# Altium schematic sheet 7_power_prot_mon.SchDoc
size A4; OrganizationName: Pluton UPV; Address1: Universitat Politècnica; Address2: de València (UPV); Address3: Camí de Vera, València; Address4: Spain; SheetNumber: 7; SheetTotal: 8
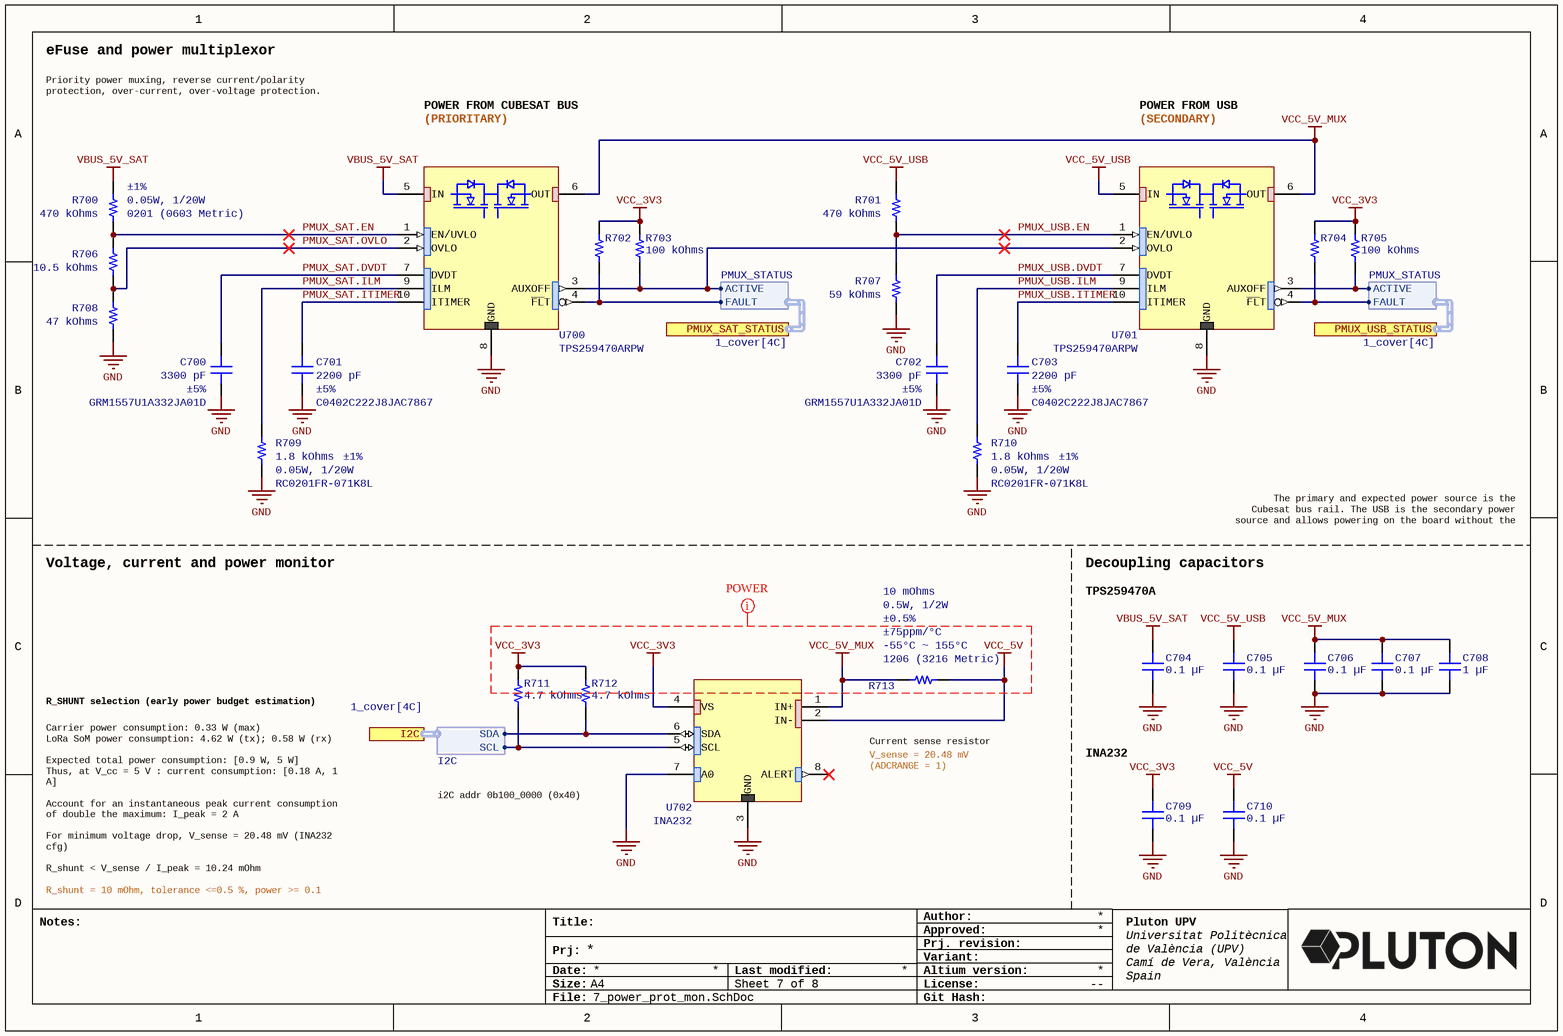
[diagram p0: 7_power_prot_mon.SchDoc]

## Parts
C700  Part Number: GRM1557U1A332JA01D  Tolerance: ±5%  [CAP 0402_1005]  (hidden comment: 3300 pF)
C701  Part Number: C0402C222J8JAC7867  Tolerance: ±5%  [CAP 0402_1005]  (hidden comment: 2200 pF)
C702  Part Number: GRM1557U1A332JA01D  Tolerance: ±5%  [CAP 0402_1005]  (hidden comment: 3300 pF)
C703  Part Number: C0402C222J8JAC7867  Tolerance: ±5%  [CAP 0402_1005]  (hidden comment: 2200 pF)
C704  0.1 µF  [CAP 0402_1005]
C705  0.1 µF  [CAP 0402_1005]
C706  0.1 µF  [CAP 0402_1005]
C707  0.1 µF  [CAP 0402_1005]
C708  1 µF  [CAP 0402_1005]
C709  0.1 µF  [CAP 0402_1005]
C710  0.1 µF  [CAP 0402_1005]
R700  470 kOhms  [RES 0201_0603]
R701  470 kOhms  [RES 0201_0603]
R702  100 kOhms  [RES 0201_0603]  (value not drawn)
R703  100 kOhms  [RES 0201_0603]
R704  100 kOhms  [RES 0201_0603]  (value not drawn)
R705  100 kOhms  [RES 0201_0603]
R706  10.5 kOhms  [RES 0201_0603]
R707  59 kOhms  [RES 0201_0603]
R708  Package / Case: 0201 (0603 Metric)  Power (Watts): 0.05W, 1/20W  Tolerance: ±1%  [RES 0201_0603]  (hidden comment: 47 kOhms)
R709  Part Number: RC0201FR-071K8L  Power (Watts): 0.05W, 1/20W  Tolerance: ±1%  [RES 0201_0603]  (hidden comment: 1.8 kOhms)
R710  Part Number: RC0201FR-071K8L  Power (Watts): 0.05W, 1/20W  Tolerance: ±1%  [RES 0201_0603]  (hidden comment: 1.8 kOhms)
R711  4.7 kOhms  [RES 0201_0603]
R712  4.7 kOhms  [RES 0201_0603]
R713  Package / Case: 1206 (3216 Metric)  Operating Temperature: -55°C ~ 155°C  Power (Watts): 0.5W, 1/2W  Temperature Coefficient: ±75ppm/°C  Tolerance: ±0.5%  [STACKPOLE CSR1206]  (hidden comment: 10 mOhms)
U700  TPS259470ARPW  [VQFN-HR-TPS25947X]
U701  TPS259470ARPW  [VQFN-HR-TPS25947X]
U702  INA232  [SOp-23-8]

## Ports
I2C (harness I2C, see 1_cover[4C]), PMUX_SAT_STATUS (harness PMUX_STATUS, see 1_cover[4C]), PMUX_USB_STATUS (harness PMUX_STATUS, see 1_cover[4C])

## Harnesses
I2C: SCL, SDA
PMUX_STATUS: ACTIVE, FAULT

## Nets
GND: C700.1 C701.1 C702.1 C703.1 C704.1 C705.1 C706.1 C707.1 C708.1 C709.1 C710.1 R707.1 R708.1 R709.1 R710.1 U700.8(GND) U701.8(GND) U702.3(GND) U702.7(A0)
VBUS_5V_SAT: C704.2 R700.2 U700.5(IN)
VCC_3V3: C709.2 R702.1 R703.1 R704.1 R705.1 R711.2 R712.2 U702.4(VS)
VCC_5V: C710.2 R713.1 U702.2(IN-)
VCC_5V_MUX: C706.2 C707.2 C708.2 R713.2 U700.6(OUT) U701.6(OUT) U702.1(IN+)
VCC_5V_USB: C705.2 R701.2 U701.5(IN)
PMUX_SAT.DVDT: C700.2 U700.7(DVDT)
PMUX_SAT.EN: R700.1 R706.2 U700.1(EN/UVLO)
PMUX_SAT.ILM: R709.2 U700.9(ILM)
PMUX_SAT.ITIMER: C701.2 U700.10(ITIMER)
PMUX_SAT.OVLO: R706.1 R708.2 U700.2(OVLO)
PMUX_USB.DVDT: C702.2 U701.7(DVDT)
PMUX_USB.EN: R701.1 R707.2 U701.1(EN/UVLO)
PMUX_USB.ILM: R710.2 U701.9(ILM)
PMUX_USB.ITIMER: C703.2 U701.10(ITIMER)
NetR702_2: R702.2 U700.4(~{FL}T) ; port PMUX_SAT_STATUS.FAULT
NetR703_2: R703.2 U700.3(AUXOFF) U701.2(OVLO) ; port PMUX_SAT_STATUS.ACTIVE
NetR704_2: R704.2 U701.4(~{FL}T) ; port PMUX_USB_STATUS.FAULT
NetR705_2: R705.2 U701.3(AUXOFF) ; port PMUX_USB_STATUS.ACTIVE
NetR711_1: R711.1 U702.5(SCL) ; port I2C.SCL
NetR712_1: R712.1 U702.6(SDA) ; port I2C.SDA

Not connected (* = marked no-connect by the designer): U702 8(ALERT)*

## Layout directives
rule Width Constraint [Pref Width = 0.4mm    Min Width = 0.2mm    Max Width = 2mm]; net class POWER: VCC_3V3, VCC_5V, VCC_5V_MUX

## Notes on the sheet
- eFuse and power multiplexor
- Priority power muxing, reverse current/polarity protection, over-current, over-voltage protection.
- POWER FROM CUBESAT BUS
- POWER FROM USB
- (PRIORITARY)
- (SECONDARY)
- Voltage, current and power monitor
- Decoupling capacitors
- The primary and expected power source is the Cubesat bus rail. The USB is the secondary power source and allows powering on the board without the EGSE, for example
- TPS259470A
- R_SHUNT selection (early power budget estimation)
- Current sense resistor
- V_sense = 20.48 mV (ADCRANGE = 1)
- INA232
- i2C addr 0b100_0000 (0x40)
- Carrier power consumption: 0.33 W (max)
  LoRa SoM power consumption: 4.62 W (tx); 0.58 W (rx)
  Expected total power consumption: [0.9 W, 5 W]
  Thus, at V_cc = 5 V : current consumption: [0.18 A, 1 A]
  Account for an instantaneous peak current consumption of double the maximum: I_peak = 2 A
  For minimum voltage drop, V_sense = 20.48 mV (INA232 cfg)
  R_shunt < V_sense / I_peak = 10.24 mOhm
  Power dissipated on R_shunt: 42 mW
- R_shunt = 10 mOhm, tolerance <=0.5 %, power >= 0.1 W
- Notes:
- Title:
- Author:
- Approved:
- Date:
- Prj:
- Size:
- A4
- Last modified:
- Altium version:
- Variant:
- Prj. revision:
- License:
- --
- File:
- Git Hash:

## Library data of the parts
C700 C702 = GRM1557U1A332JA01D: CAP CER 3300PF 10V U2J 0402; manufacturer: Murata Electronics; Value: 3300 pF; Applications: General Purpose; Capacitance: 3300 pF; componentlink1description: Datasheet; componentlink1url: https://www.murata.com/~/media/webrenewal/support/library/catalog/products/capacitor/mlcc/c02e.ashx?la=en-us; componentlink2description: DigiKey Link; componentlink2url: https://www.digikey.com/en/products/detail/murata-electronics/GRM1557U1A332JA01D/2610576; Device Package: 0402 (1005 Metric); lastupdated: 09/02/2024 20:04:23; Lifecycle Status: Active; Minimum Order: 1; Mounting Type: Surface Mount, MLCC; Operating Temperature: -55°C ~ 125°C; Package / Case: 0402 (1005 Metric); packaging: TapeAndReel; partid: 11059; Part Status: Active; price: 0.01; series: GRM; Size / Dimension: 0.039" L x 0.020" W (1.00mm x 0.50mm); Supplier 1: DigiKey; Supplier Part Number 1: 490-6276-1-ND; Temperature Coefficient: U2J; Thickness (Max): 0.022" (0.55mm); Voltage - Rated: 10V
C701 C703 = C0402C222J8JAC7867: CAP CER 2200PF 10V U2J 0402; manufacturer: KEMET; Value: 2200 pF; Applications: General Purpose; Capacitance: 2200 pF; componentlink1description: Datasheet; componentlink1url: https://api.kemet.com/component-edge/download/datasheet/C0402C222J8JAC7867.pdf; componentlink2description: DigiKey Link; componentlink2url: https://www.digikey.com/en/products/detail/kemet/C0402C222J8JAC7867/6123085; Device Package: 0402 (1005 Metric); Features: Low ESL, Low Dissipation Factor; lastupdated: 09/02/2024 20:04:24; Lifecycle Status: Active; Minimum Order: 1; Mounting Type: Surface Mount, MLCC; Operating Temperature: -55°C ~ 125°C; Package / Case: 0402 (1005 Metric); packaging: TapeAndReel; partid: 41131; Part Status: Active; price: 0.02; series: SMD Comm U2J; Size / Dimension: 0.039" L x 0.020" W (1.00mm x 0.50mm); Supplier 1: DigiKey; Supplier Part Number 1: 399-13404-1-ND; Temperature Coefficient: U2J; Thickness (Max): 0.022" (0.55mm); Voltage - Rated: 10V
C704-C707 C709 C710 = C0402C104K4RECAUTO: CAP CER 0402 0.1UF 16V X7R 10%; manufacturer: KEMET; Part Number: C0402C104K4RECAUTO; Value: 0.1 µF; Applications: Automotive, ESD Protection; Capacitance: 0.1 µF; componentlink1description: Datasheet; componentlink1url: https://api.kemet.com/component-edge/download/datasheet/C0402C104K4RECAUTO.pdf; componentlink2description: DigiKey Link; componentlink2url: https://www.digikey.com/en/products/detail/kemet/C0402C104K4RECAUTO/8563695; Device Package: 0402 (1005 Metric); lastupdated: 09/02/2024 20:04:38; Lifecycle Status: Active; Minimum Order: 1; Mounting Type: Surface Mount, MLCC; Operating Temperature: -55°C ~ 125°C; Package / Case: 0402 (1005 Metric); packaging: TapeAndReel; partid: 1731; Part Status: Active; price: 0.01; Ratings: AEC-Q200; series: ESD SMD Auto X7R; Size / Dimension: 0.039" L x 0.020" W (1.00mm x 0.50mm); Supplier 1: DigiKey; Supplier Part Number 1: 399-17167-1-ND; Temperature Coefficient: X7R; Thickness (Max): 0.022" (0.55mm); Tolerance: ±10%; Voltage - Rated: 16V
C708 = GRT155C71A105KE13D: CAP CER 1UF 10V X7S 0402; manufacturer: Murata Electronics; Tolerance: ±10%; Part Number: GRT155C71A105KE13D; Value: 1 µF; Applications: Automotive; Capacitance: 1 µF; componentlink1description: Datasheet; componentlink1url: https://search.murata.co.jp/Ceramy/image/img/A01X/G101/ENG/GRT155C71A105KE13-01.pdf; componentlink2description: DigiKey Link; componentlink2url: https://www.digikey.com/en/products/detail/murata-electronics/GRT155C71A105KE13D/10695747; Device Package: 0402 (1005 Metric); lastupdated: 09/02/2024 20:04:05; Lifecycle Status: Active; Minimum Order: 1; Mounting Type: Surface Mount, MLCC; Operating Temperature: -55°C ~ 125°C; Package / Case: 0402 (1005 Metric); packaging: TapeAndReel; partid: 47127; Part Status: Active; price: 0.04; Ratings: AEC-Q200; series: GRT; Size / Dimension: 0.039" L x 0.020" W (1.00mm x 0.50mm); Supplier 1: DigiKey; Supplier Part Number 1: 490-GRT155C71A105KE13DCT-ND; Temperature Coefficient: X7S; Thickness (Max): 0.024" (0.60mm); Voltage - Rated: 10V
R700 R701 = RC0201FR-13470KL: RES 470K OHM 1% 1/20W 0201; Manufacturer: Yageo; Power (Watts): 0.05W, 1/20W; Temperature Coefficient: ±200ppm/°C; Part Number: RC0201FR-13470KL; Value: 470 kOhms; ComponentLink1Description: Datasheet; ComponentLink1URL: https://www.yageo.com/upload/media/product/products/datasheet/rchip/PYu-RC_Group_51_RoHS_L_12.pdf; ComponentLink2Description: DigiKey Link; ComponentLink2URL: https://www.digikey.com/en/products/detail/yageo/RC0201FR-13470KL/17017807; Composition: Thick Film; Device Package: 0201 (0603 Metric); Features: Moisture Resistant; Height - Seated (Max): 0.010" (0.26mm); LastUpdated: 04/06/2024 19:11:46; Lifecycle Status: Active; Minimum Order: 1; Number of Terminations: 2; Operating Temperature: -55°C ~ 125°C; Package / Case: 0201 (0603 Metric); Packaging: CutTape; PartId: 84336; Price: 0.01; Resistance: 470 kOhms; Series: RC_L; Size / Dimension: 0.024" L x 0.012" W (0.60mm x 0.30mm); Supplier 1: DigiKey; Supplier Part Number 1: 13-RC0201FR-13470KLCT-ND; Supplier Device Package: 0201; Tolerance: ±1%
R702-R705 = RC0201FR-13100KL: RES 100K OHM 1% 1/20W 0201; Manufacturer: Yageo; Power (Watts): 0.05W, 1/20W; Temperature Coefficient: ±200ppm/°C; Part Number: RC0201FR-13100KL; Value: 100 kOhms; ComponentLink1Description: Datasheet; ComponentLink1URL: https://www.yageo.com/upload/media/product/productsearch/datasheet/rchip/PYu-RC_Group_51_RoHS_L_12.pdf; ComponentLink2Description: DigiKey Link; ComponentLink2URL: https://www.digikey.com/en/products/detail/yageo/RC0201FR-13100KL/17014509; Composition: Thick Film; Device Package: 0201 (0603 Metric); Features: Moisture Resistant; Height - Seated (Max): 0.010" (0.26mm); LastUpdated: 04/06/2024 19:11:47; Lifecycle Status: Active; Minimum Order: 1; Number of Terminations: 2; Operating Temperature: -55°C ~ 125°C; Package / Case: 0201 (0603 Metric); Packaging: CutTape; PartId: 80199; Price: 0.01; Resistance: 100 kOhms; Series: RC_L; Size / Dimension: 0.024" L x 0.012" W (0.60mm x 0.30mm); Supplier 1: DigiKey; Supplier Part Number 1: 13-RC0201FR-13100KLCT-ND; Supplier Device Package: 0201; Tolerance: ±1%
R706 = RC0201FR-0710K5L: RES 10.5K OHM 1% 1/20W 0201; Manufacturer: Yageo; Power (Watts): 0.05W, 1/20W; Temperature Coefficient: ±200ppm/°C; Part Number: RC0201FR-0710K5L; Value: 10.5 kOhms; ComponentLink1Description: Datasheet; ComponentLink1URL: https://www.yageo.com/upload/media/product/productsearch/datasheet/rchip/PYu-RC_Group_51_RoHS_L_10.pdf; ComponentLink2Description: DigiKey Link; ComponentLink2URL: https://www.digikey.com/en/products/detail/yageo/RC0201FR-0710K5L/1948868; Composition: Thick Film; Device Package: 0201 (0603 Metric); Features: Moisture Resistant; Height - Seated (Max): 0.010" (0.26mm); LastUpdated: 04/06/2024 19:12:00; Lifecycle Status: Active; Minimum Order: 1; Number of Terminations: 2; Operating Temperature: -55°C ~ 125°C; Package / Case: 0201 (0603 Metric); Packaging: TapeAndReel; PartId: 781; Part Status: Active; Price: 0.01; Resistance: 10.5 kOhms; Series: RC_L; Size / Dimension: 0.024" L x 0.012" W (0.60mm x 0.30mm); Supplier 1: DigiKey; Supplier Part Number 1: 311-10.5KMCT-ND; Supplier Device Package: 0201; Tolerance: ±1%
R707 = RC0201FR-0759KL: RES 59K OHM 1% 1/20W 0201; Manufacturer: Yageo; Power (Watts): 0.05W, 1/20W; Temperature Coefficient: ±200ppm/°C; Part Number: RC0201FR-0759KL; Value: 59 kOhms; ComponentLink1Description: Datasheet; ComponentLink1URL: https://www.yageo.com/upload/media/product/productsearch/datasheet/rchip/PYu-RC_Group_51_RoHS_L_10.pdf; ComponentLink2Description: DigiKey Link; ComponentLink2URL: https://www.digikey.com/en/products/detail/yageo/RC0201FR-0759KL/5280599; Composition: Thick Film; Device Package: 0201 (0603 Metric); Features: Moisture Resistant; Height - Seated (Max): 0.010" (0.26mm); LastUpdated: 04/06/2024 19:11:58; Lifecycle Status: Active; Minimum Order: 1; Number of Terminations: 2; Operating Temperature: -55°C ~ 125°C; Package / Case: 0201 (0603 Metric); Packaging: TapeAndReel; PartId: 1469; Part Status: Active; Price: 0.01; Resistance: 59 kOhms; Series: RC_L; Size / Dimension: 0.024" L x 0.012" W (0.60mm x 0.30mm); Supplier 1: DigiKey; Supplier Part Number 1: YAG2739CT-ND; Supplier Device Package: 0201; Tolerance: ±1%
R708 = RC0201FR-0747KL: RES 47K OHM 1% 1/20W 0201; Manufacturer: Yageo; Temperature Coefficient: ±200ppm/°C; Part Number: RC0201FR-0747KL; Value: 47 kOhms; ComponentLink1Description: Datasheet; ComponentLink1URL: https://www.yageo.com/upload/media/product/productsearch/datasheet/rchip/PYu-RC_Group_51_RoHS_L_10.pdf; ComponentLink2Description: DigiKey Link; ComponentLink2URL: https://www.digikey.com/en/products/detail/yageo/RC0201FR-0747KL/3202409; Composition: Thick Film; Device Package: 0201 (0603 Metric); Features: Moisture Resistant; Height - Seated (Max): 0.010" (0.26mm); LastUpdated: 04/06/2024 19:11:56; Lifecycle Status: Active; Minimum Order: 1; Number of Terminations: 2; Operating Temperature: -55°C ~ 125°C; Packaging: TapeAndReel; PartId: 2291; Part Status: Active; Price: 0.01; Resistance: 47 kOhms; Series: RC_L; Size / Dimension: 0.024" L x 0.012" W (0.60mm x 0.30mm); Supplier 1: DigiKey; Supplier Part Number 1: 311-47KMCT-ND; Supplier Device Package: 0201
R709 R710 = RC0201FR-071K8L: RES 1.8K OHM 1% 1/20W 0201; Manufacturer: Yageo; Temperature Coefficient: ±200ppm/°C; Value: 1.8 kOhms; ComponentLink1Description: Datasheet; ComponentLink1URL: https://www.yageo.com/upload/media/product/productsearch/datasheet/rchip/PYu-RC_Group_51_RoHS_L_10.pdf; ComponentLink2Description: DigiKey Link; ComponentLink2URL: https://www.digikey.com/en/products/detail/yageo/RC0201FR-071K8L/5280352; Composition: Thick Film; Device Package: 0201 (0603 Metric); Features: Moisture Resistant; Height - Seated (Max): 0.010" (0.26mm); LastUpdated: 04/06/2024 19:11:58; Lifecycle Status: Active; Minimum Order: 1; Number of Terminations: 2; Operating Temperature: -55°C ~ 125°C; Package / Case: 0201 (0603 Metric); Packaging: TapeAndReel; PartId: 1426; Part Status: Active; Price: 0.01; Resistance: 1.8 kOhms; Series: RC_L; Size / Dimension: 0.024" L x 0.012" W (0.60mm x 0.30mm); Supplier 1: DigiKey; Supplier Part Number 1: YAG2492CT-ND; Supplier Device Package: 0201
R711 R712 = AC0201FR-074K7L: RES SMD 4.7K OHM 1% 1/20W 0201; Manufacturer: Yageo; Power (Watts): 0.05W, 1/20W; Temperature Coefficient: ±200ppm/°C; Part Number: AC0201FR-074K7L; Value: 4.7 kOhms; ComponentLink1Description: Datasheet; ComponentLink1URL: https://www.yageo.com/upload/media/product/productsearch/datasheet/rchip/PYu-AC_51_RoHS_L_7.pdf; ComponentLink2Description: DigiKey Link; ComponentLink2URL: https://www.digikey.com/en/products/detail/yageo/AC0201FR-074K7L/5894686; Composition: Thick Film; Device Package: 0201 (0603 Metric); Features: Automotive AEC-Q200, Moisture Resistant; Height - Seated (Max): 0.010" (0.26mm); LastUpdated: 04/06/2024 19:11:59; Lifecycle Status: Active; Minimum Order: 1; Number of Terminations: 2; Operating Temperature: -55°C ~ 155°C; Package / Case: 0201 (0603 Metric); Packaging: CutTape; PartId: 978; Part Status: Active; Price: 0.01; Ratings: AEC-Q200; Resistance: 4.7 kOhms; Series: AC; Size / Dimension: 0.024" L x 0.012" W (0.60mm x 0.30mm); Supplier 1: DigiKey; Supplier Part Number 1: YAG3426CT-ND; Supplier Device Package: 0201; Tolerance: ±1%
R713 = L4T12FR010DER: 0.01 OHM 1206 0.5% 0.50W; Manufacturer: Ohmite; Part Number: L4T12FR010DER; ComponentLink1Description: Datasheet; ComponentLink1URL: https://www.ohmite.com/assets/docs/acl_l4t.pdf; ComponentLink2Description: DigiKey Link; ComponentLink2URL: https://www.digikey.com/en/products/detail/ohmite/L4T12FR010DER/10385195; Composition: Thick Film; Device Package: 1206 (3216 Metric); Features: Current Sense; Height - Seated (Max): 0.026" (0.65mm); LastUpdated: 03/06/2024 19:49:34; Lifecycle Status: Active; Minimum Order: 1; Number of Terminations: 4; Packaging: CutTape; PartId: 2184; Part Status: Active; Price: 0.08; Resistance: 10 mOhms; Series: L4T12; Size / Dimension: 0.118" L x 0.063" W (3.00mm x 1.60mm); Supplier 1: DigiKey; Supplier Part Number 1: 273-L4T12FR010DERCT-ND; Supplier Device Package: 1206; Value: 10 mOhms
U700 U701 = TPS259470ARPW: 2.7-V–23-V, 5.5-A, 28-mΩ True Reverse Current Blocking eFuse with Input Reverse Polarity Protection. Variant: Adjustable OVLO, Active Current Limit, AUXOUT output, FAULT indicatori, Auto-Retry
U702 = INA232: 48-V, 16-Bit, Current, Voltage, and Power Monitor With an I2C Interface